# Altium schematic sheet DP83848.SchDoc
size A4
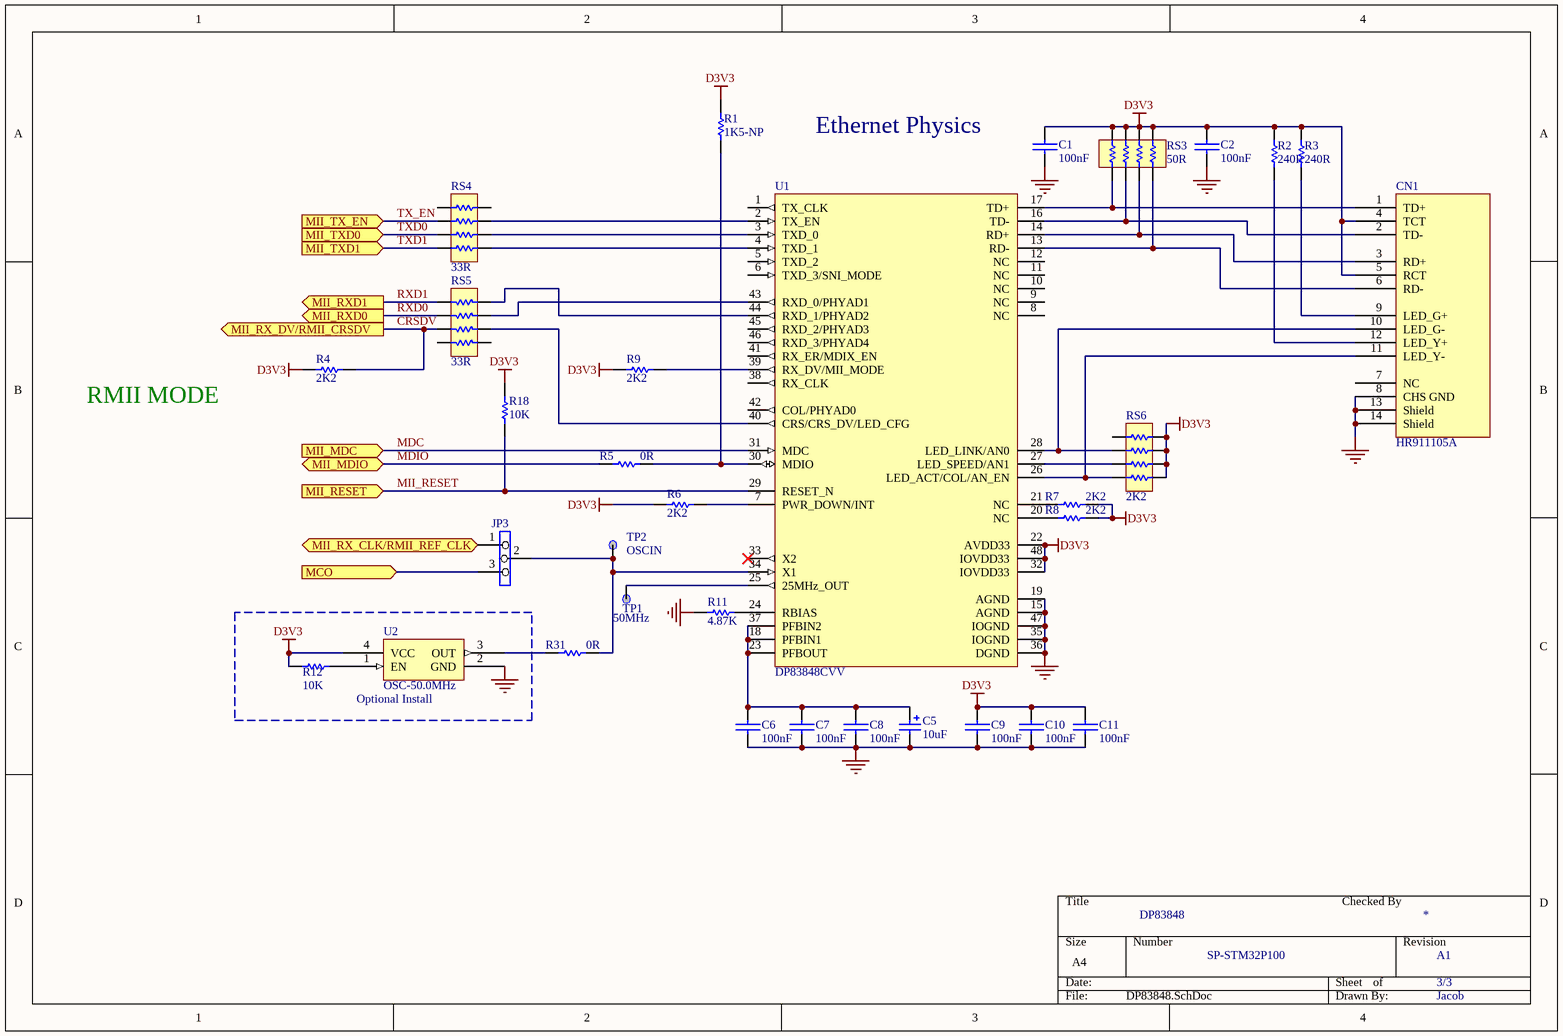
[diagram p0: DP83848.SchDoc]

## Parts
C1  100nF  [0603M]
C2  100nF  [0603M]
C5  10uF  [TAN-A]
C6  100nF  [0603M]
C7  100nF  [0603M]
C8  100nF  [0603M]
C9  100nF  [0603M]
C10  100nF  [0603M]
C11  100nF  [0603M]
CN1  HR911105A  [HR911105A]
JP3  (no value)  [HDR1X3/2.00MM]
R1  1K5-NP  [0603M]
R2  240R  [0603M]
R3  240R  [0603M]
R4  2K2  [0603M]
R5  0R  [0603M]
R6  2K2  [0603M]
R7  2K2  [0603M]
R8  2K2  [0603M]
R9  2K2  [0603M]
R11  4.87K  [0603M]
R12  10K  [0603M]
R18  10K  [0603M]
R31  0R  [0603M]
RS3  50R  [RES-4B]
RS4  33R  [RES-4B]
RS5  33R  [RES-4B]
RS6  2K2  [RES-4B]
TP1  50MHz  [TP HOLE]
TP2  OSCIN  [TP]
U1  DP83848CVV  [LQFP48]
U2  OSC-50.0MHz  [XTAL_5X7]

## Blocks framed on the sheet
Optional Install: R12 U2

## Ports
MCO (in), MII_MDC (in), MII_MDIO (bidir), MII_RESET (in), MII_RX_CLK/RMII_REF_CLK (out), MII_RX_DV/RMII_CRSDV (out), MII_RXD0 (out), MII_RXD1 (out), MII_TX_EN (in), MII_TXD0 (in), MII_TXD1 (in)

## Nets
D3V3: C1.2 C2.2 C9.1 C10.2 C11.2 CN1.4(TCT) CN1.5(RCT) R1.2 R2.2 R3.2 R4.2 R6.1 R7.2 R8.2 R9.2 R12.1 R18.2 RS3.1 RS3.3 RS3.5 RS3.7 RS6.1 RS6.3 RS6.5 RS6.7 U1.22(AVDD33) U1.32(IOVDD33) U1.48(IOVDD33) U2.4(VCC)
GND: C1.1 C2.1 C5.2 C6.2 C7.1 C8.1 C9.2 C10.1 C11.1 CN1.8(CHS_GND) CN1.13(Shield) CN1.14(Shield) R11.1 U1.15(AGND) U1.19(AGND) U1.35(IOGND) U1.36(DGND) U1.47(IOGND) U2.2(GND)
CRSDV: R4.1 RS5.6 ; port MII_RX_DV/RMII_CRSDV
MCO: JP3.3 ; port MCO
MDC: U1.31(MDC) ; port MII_MDC
MDIO: R5.1 ; port MII_MDIO
MII_RESET: R18.1 U1.29(RESET_N) ; port MII_RESET
MII_RX_CLK/RMII_REF_CLK: JP3.1 ; port MII_RX_CLK/RMII_REF_CLK
RXD0: RS5.4 ; port MII_RXD0
RXD1: RS5.2 ; port MII_RXD1
TX_EN: RS4.6 ; port MII_TX_EN
TXD0: RS4.4 ; port MII_TXD0
TXD1: RS4.2 ; port MII_TXD1
NetC5_1: C5.1 C6.1 C7.2 C8.2 U1.18(PFBIN1) U1.23(PFBOUT) U1.37(PFBIN2)
NetCN1_1: CN1.1(TD+) RS3.8 U1.17(TD+)
NetCN1_2: CN1.2(TD-) RS3.6 U1.16(TD-)
NetCN1_3: CN1.3(RD+) RS3.4 U1.14(RD+)
NetCN1_6: CN1.6(RD-) RS3.2 U1.13(RD-)
NetCN1_9: CN1.9(LED_G+) R3.1
NetCN1_10: CN1.10(LED_G-) RS6.6 U1.28(LED_LINK/AN0)
NetCN1_11: CN1.11(LED_Y-) RS6.2 U1.26(LED_ACT/COL/AN_EN)
NetCN1_12: CN1.12(LED_Y+) R2.1
NetJP3_2: JP3.2 R31.2 TP2.1 U1.34(X1)
NetR1_1: R1.1 R5.2 U1.30(MDIO)
NetR6_2: R6.2 U1.7(PWR_DOWN/INT)
NetR7_1: R7.1 U1.21(NC)
NetR8_1: R8.1 U1.20(NC)
NetR9_1: R9.1 U1.39(RX_DV/MII_MODE)
NetR11_2: R11.2 U1.24(RBIAS)
NetR12_2: R12.2 U2.1(EN)
NetR31_1: R31.1 U2.3(OUT)
NetRS4_1: RS4.1 U1.4(TXD_1)
NetRS4_3: RS4.3 U1.3(TXD_0)
NetRS4_5: RS4.5 U1.2(TX_EN)
NetRS5_1: RS5.1 U1.44(RXD_1/PHYAD2)
NetRS5_3: RS5.3 U1.43(RXD_0/PHYAD1)
NetRS5_5: RS5.5 U1.40(CRS/CRS_DV/LED_CFG)
NetRS6_4: RS6.4 U1.27(LED_SPEED/AN1)
NetTP1_1: TP1.1 U1.25(25MHz_OUT)

Not connected (* = marked no-connect by the designer): CN1 7(NC); RS4 7 8; RS5 7 8; RS6 8; U1 1(TX_CLK) 5(TXD_2) 6(TXD_3/SNI_MODE) 8(NC) 9(NC) 10(NC) 11(NC) 12(NC) 33(X2)* 38(RX_CLK) 41(RX_ER/MDIX_EN) 42(COL/PHYAD0) 45(RXD_2/PHYAD3) 46(RXD_3/PHYAD4)

## Notes on the sheet
- (near C1) Ethernet Physics
- RMII MODE
- DP83848
- Checked By
- *
- SP-STM32P100
- A1
- 3/3
- Jacob

## Library data of the parts
C1 C2 C6-C11 = CAP: Capacitor
C5 = Cap Pol1: Polarized Capacitor (Radial); Published: 8-Jun-2000; Revision: July-2002: Re-released for DXP Platform.; Publisher: Altium Limited; Value: 10uF
CN1 = HR911105A: RJ45 From Hanren
JP3 = Jumper3
R1-R9 R11 R12 R18 R31 = Res1: Resistor; Value: 1K; Published: 8-Jun-2000; Revision: July-2002: Re-released for DXP Platform.; Publisher: Altium Limited
RS3-RS6 = Resister Array
TP1 TP2 = TP
U2 = SM7745HEV-50.0M